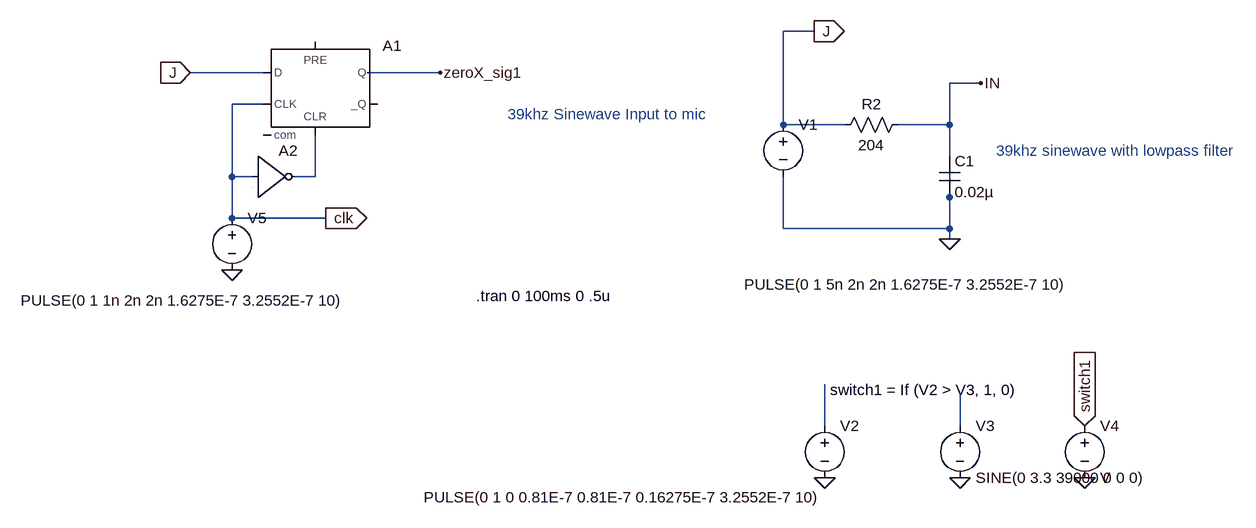
[diagram p0: schematic TransmissionPulse_Fully_Matched.asc]
TransmissionPulse_Fully_Matched.asc, the LTspice schematic file:
Version 4
SHEET 1 1632 704
WIRE -96 -96 -144 -96
WIRE -944 -32 -1056 -32
WIRE -672 -32 -784 -32
WIRE 160 -16 112 -16
WIRE -944 16 -992 16
WIRE -144 48 -144 -96
WIRE -48 48 -144 48
WIRE 112 48 112 -16
WIRE 112 48 32 48
WIRE 112 96 112 48
WIRE -992 128 -992 16
WIRE -960 128 -992 128
WIRE -864 128 -864 64
WIRE -864 128 -896 128
WIRE 112 160 112 112
WIRE -992 192 -992 128
WIRE -848 192 -992 192
WIRE -144 208 -144 128
WIRE 112 208 112 160
WIRE 112 208 -144 208
WIRE 112 224 112 208
WIRE -80 512 -80 448
WIRE 128 512 128 464
FLAG 112 224 0
FLAG 160 -16 IN
FLAG -96 -96 J
IOPIN -96 -96 Out
FLAG -992 272 0
FLAG -848 192 clk
IOPIN -848 192 Out
FLAG -1056 -32 J
IOPIN -1056 -32 In
FLAG -672 -32 zeroX_sig1
FLAG -80 592 0
FLAG 128 592 0
FLAG 320 592 0
FLAG 320 512 switch1
IOPIN 320 512 In
SYMBOL voltage -144 32 R0
WINDOW 3 -60 262 Left 2
WINDOW 123 0 0 Left 0
WINDOW 39 0 0 Left 0
SYMATTR Value PULSE(0 1 5n 2n 2n 1.6275E-7 3.2552E-7 10)
SYMATTR InstName V1
SYMBOL res 48 32 R90
WINDOW 0 0 56 VBottom 2
WINDOW 3 32 56 VTop 2
SYMATTR InstName R2
SYMATTR Value 204
SYMBOL cap 96 96 R0
SYMATTR InstName C1
SYMATTR Value 0.02µ
SYMBOL voltage -992 176 R0
WINDOW 3 -325 143 Left 2
WINDOW 123 0 0 Left 0
WINDOW 39 0 0 Left 0
SYMATTR Value PULSE(0 1 1n 2n 2n 1.6275E-7 3.2552E-7 10)
SYMATTR InstName V5
SYMBOL Digital\\dflop -864 -80 R0
SYMATTR InstName A1
SYMBOL Digital\\inv -960 64 R0
SYMATTR InstName A2
SYMBOL voltage -80 496 R0
WINDOW 3 -617 126 Left 2
WINDOW 123 0 0 Left 0
WINDOW 39 0 0 Left 0
SYMATTR Value PULSE(0 1 0 0.81E-7 0.81E-7 0.16275E-7 3.2552E-7 10)
SYMATTR InstName V2
SYMBOL voltage 128 496 R0
WINDOW 123 0 0 Left 0
WINDOW 39 0 0 Left 0
SYMATTR InstName V3
SYMATTR Value SINE(0 3.3 39000 0 0 0)
SYMBOL voltage 320 496 R0
SYMATTR InstName V4
TEXT -616 312 Left 2 !.tran 0 100ms 0 .5u
TEXT 184 88 Left 2 ;39khz sinewave with lowpass filter
TEXT -568 32 Left 2 ;39khz Sinewave Input to mic
TEXT -72 456 Left 2 !switch1 = If (V2 > V3, 1, 0)

The netlist it stands for:
* TransmissionPulse_Fully_Matched.asc
V1 J 0 PULSE(0 1 5n 2n 2n 1.6275E-7 3.2552E-7 10)
R2 IN J 204
C1 IN 0 0.02µ
V5 clk 0 PULSE(0 1 1n 2n 2n 1.6275E-7 3.2552E-7 10)
A1 J 0 clk 0 N001 0 zeroX_sig1 0 DFLOP
A2 clk 0 0 0 0 N001 0 0 BUF
V2 N002 0 PULSE(0 1 0 0.81E-7 0.81E-7 0.16275E-7 3.2552E-7 10)
V3 N003 0 SINE(0 3.3 39000 0 0 0)
V4 switch1 0 V
.tran 0 100ms 0 .5u
* 39khz sinewave with lowpass filter
* 39khz Sinewave Input to mic
switch1 = If (V2 > V3, 1, 0)
.backanno
.end